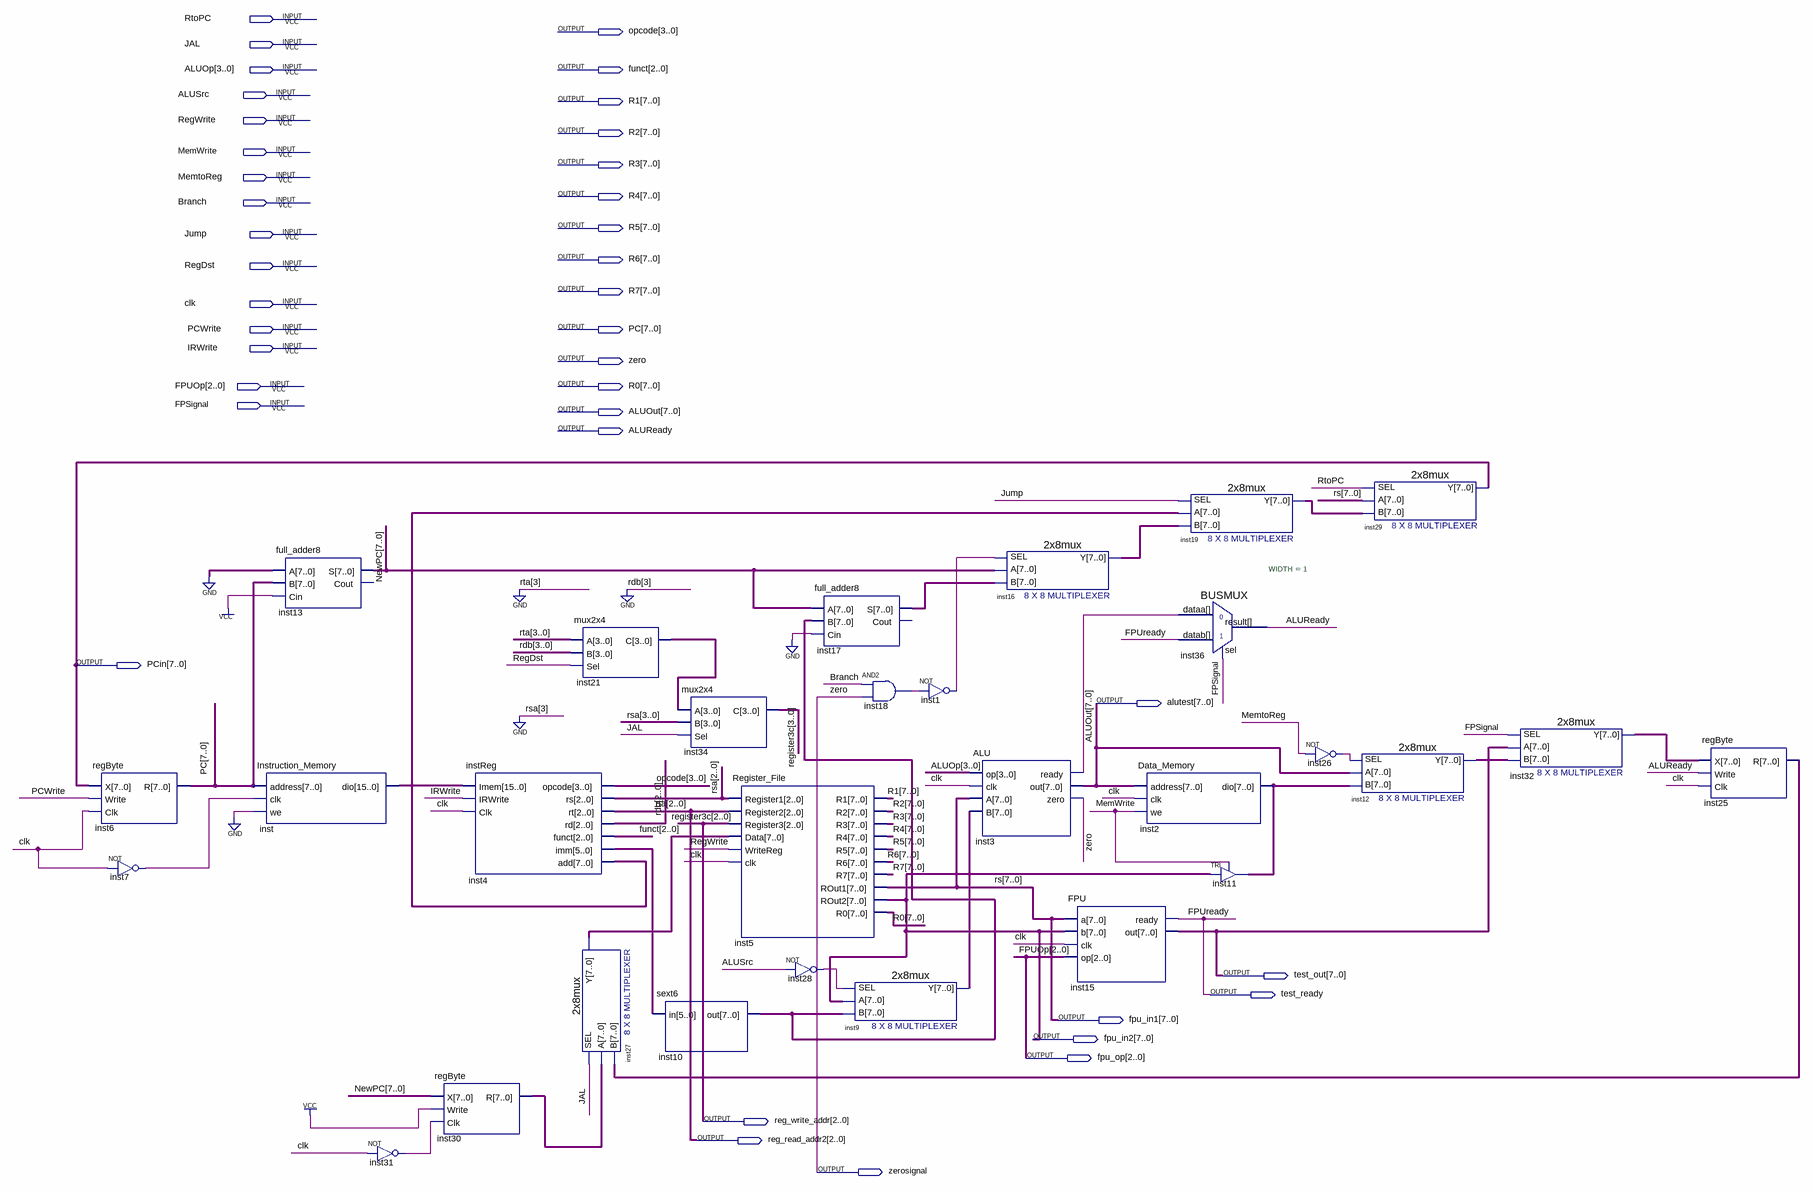
[diagram p0: schematic sheet]
// Quartus schematic Datapath.bdf as structural Verilog: 29 symbols, 39 pins
module Datapath (
  input  RtoPC,
  input  JAL,
  input  [3:0] ALUOp,
  input  ALUSrc,
  input  RegWrite,
  input  MemWrite,
  input  MemtoReg,
  input  Branch,
  input  Jump,
  input  RegDst,
  input  clk,
  input  PCWrite,
  input  IRWrite,
  input  [2:0] FPUOp,
  input  FPSignal,
  output [3:0] opcode,
  output [2:0] funct,
  output [7:0] R1,
  output [7:0] R2,
  output [7:0] R3,
  output [7:0] R4,
  output [7:0] R5,
  output [7:0] R6,
  output [7:0] R7,
  output [7:0] PC,
  output zero,
  output [7:0] R0,
  output [7:0] ALUOut,
  output ALUReady,
  output [7:0] PCin,
  output [7:0] alutest,
  output [7:0] test_out,
  output test_ready,
  output [7:0] fpu_in1,
  output [7:0] fpu_in2,
  output [2:0] fpu_op,
  output [2:0] reg_write_addr,
  output [2:0] reg_read_addr2,
  output zerosignal
);

  wire inst1_out, inst3_ready, inst7_out, inst18_out, inst26_out, inst28_out, inst31_out;
  wire [2:0] rdb, rsa;
  wire [3:0] inst21_c;
  wire [3:3] register3c;
  wire [5:0] inst4_imm;
  wire [7:0] inst2_dio, inst4_add, inst9_y, inst10_out, inst12_y, inst16_y, inst17_s, inst19_y, inst25_r,
       inst27_y, inst30_r, inst32_y, NewPC;
  wire [15:0] inst_dio;

  regByte inst6 (.X(PCin), .Write(PCWrite), .Clk(clk), .R(PC));
  not inst7 (inst7_out, clk);
  full_adder8 inst13 (.A({8{1'b0}}), .B(PC), .Cin(1'b1), .S(NewPC));  // open: Cout
  Instruction_Memory inst (.address(PC), .clk(inst7_out), .we(1'b0), .dio(inst_dio));
  not inst31 (inst31_out, clk);
  regByte inst30 (.X(NewPC), .Write(1'b1), .Clk(inst31_out), .R(inst30_r));
  instReg inst4 (
    .Imem(inst_dio), .IRWrite(IRWrite), .Clk(clk), .opcode(opcode), .rs(rsa), .rt(reg_read_addr2), .rd(rdb),
    .funct(funct), .imm(inst4_imm), .add(inst4_add));
  mux2x4 inst21 (.A({1'b0, reg_read_addr2}), .B({1'b0, rdb}), .Sel(RegDst), .C(inst21_c));
  \2x8mux  inst27 (.SEL(JAL), .A(inst30_r), .B(inst25_r), .Y(inst27_y));
  mux2x4 inst34 (.A(inst21_c), .B({1'b0, rsa}), .Sel(JAL), .C({register3c[3], reg_write_addr}));
  sext6 inst10 (.in(inst4_imm), .out(inst10_out));
  Register_File inst5 (
    .Register1(rsa), .Register2(reg_read_addr2), .Register3(reg_write_addr), .Data(inst27_y),
    .WriteReg(RegWrite), .clk(clk), .R1(R1), .R2(R2), .R3(R3), .R4(R4), .R5(R5), .R6(R6), .R7(R7),
    .ROut1(fpu_in1), .ROut2(fpu_in2), .R0(R0));
  not inst28 (inst28_out, ALUSrc);
  full_adder8 inst17 (.A(NewPC), .B(inst10_out), .Cin(1'b0), .S(inst17_s));  // open: Cout
  and inst18 (inst18_out, Branch, zero);
  \2x8mux  inst9 (.SEL(inst28_out), .A(fpu_in2), .B(inst10_out), .Y(inst9_y));
  not inst1 (inst1_out, inst18_out);
  ALU inst3 (.op(ALUOp), .clk(clk), .A(fpu_in1), .B(inst9_y), .ready(inst3_ready), .out(ALUOut), .zero(zero));
  \2x8mux  inst16 (.SEL(inst1_out), .A(NewPC), .B(inst17_s), .Y(inst16_y));
  FPU inst15 (.a(fpu_in1), .b(fpu_in2), .clk(clk), .op(FPUOp), .ready(test_ready), .out(test_out));
  Data_Memory inst2 (.address(ALUOut), .clk(clk), .we(MemWrite), .dio(inst2_dio));
  \2x8mux  inst19 (.SEL(Jump), .A(inst4_add), .B(inst16_y), .Y(inst19_y));
  BUSMUX #(.WIDTH(1)) inst36 (.datab(test_ready), .sel(FPSignal), .dataa(inst3_ready), .result(ALUReady));
  TRI inst11[7:0] (.IN(fpu_in2), .OE(MemWrite), .OUT(inst2_dio));
  not inst26 (inst26_out, MemtoReg);
  \2x8mux  inst29 (.SEL(RtoPC), .A(fpu_in1), .B(inst19_y), .Y(PCin));
  \2x8mux  inst12 (.SEL(inst26_out), .A(ALUOut), .B(inst2_dio), .Y(inst12_y));
  \2x8mux  inst32 (.SEL(FPSignal), .A(test_out), .B(inst12_y), .Y(inst32_y));
  regByte inst25 (.X(inst32_y), .Write(ALUReady), .Clk(clk), .R(inst25_r));

  assign alutest = ALUOut;
  assign fpu_op = FPUOp;
  assign zerosignal = zero;

  // Other names for the same wires on the sheet: rs[7:0] = fpu_in1; register3c[2:0] = reg_write_addr;
  //   rta[2:0] = reg_read_addr2; FPUready = test_ready
endmodule
